# Altium schematic sheet 01-CoverPage.SchDoc: =DocumentName
size A3; ApprovedBy: 雪域蓝天; CheckedBy: 雪域蓝天; Author: 雪域蓝天; CompanyName: AISkyLab; DrawnBy: 雪域蓝天; Engineer: 雪域蓝天; Organization: AISkyLab; Address1: 海淀; Address3: 北京; Address4: 中国; DocumentNumber: 1; Revision: V1I1; SheetNumber: 1; SheetTotal: 2; ENG_APP_DATE: --/--/--; DSN_APP_DATE: --/--/--; CHK_APP_DATE: --/--/--; website: aiskylab.com
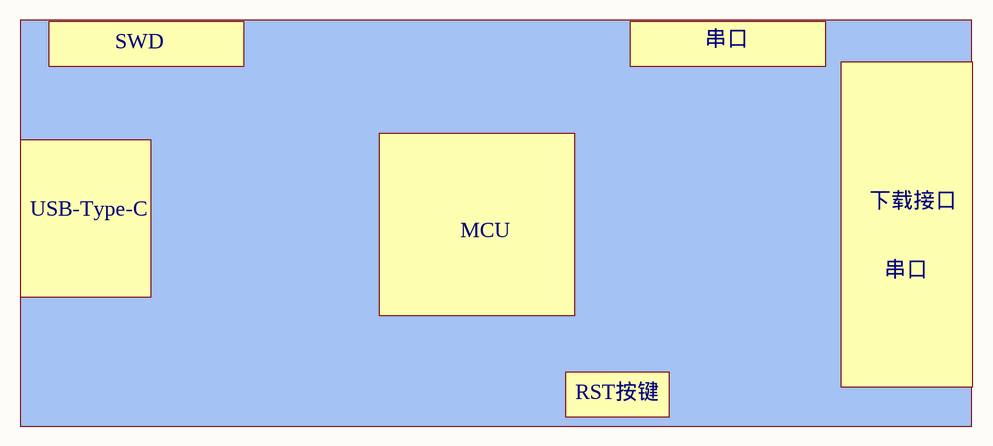
[diagram p0: 01-CoverPage.SchDoc]

## Notes on the sheet
- 串口
- SWD
- USB-Type-C
- MCU
- 下载接口
- RST按键
- 公
- 设计
- 日期
- 司
- 绘制
- 审核
- 批准
- 标题(Title):
- Size:
- Date:
- A3
- Number:
- Time:
- Revision:
- Sheet
- of
- File: